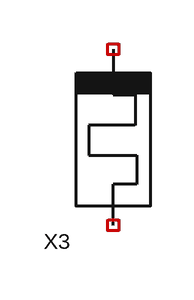
[diagram p0: schematic cell.asc]
cell.asc, the LTspice schematic file:
Version 4
SHEET 1 2484 3204
SYMBOL memristor -528 1136 R180
WINDOW 3 0 -21 Invisible 2
WINDOW 39 0 -42 Invisible 2
SYMATTR SpiceLine rmin=100 rmax=390 rinit=100 alpha=1E10 beta=0 gamma=0.1 VtR=2 VtL=-0.5 yo=0.0001 m=82 fo=310 Lo=5
SYMATTR InstName X3

The netlist it stands for:
* cell.asc
XX3 NC_01 NC_02 memristor rmin=100 rmax=390 rinit=100 alpha=1E10 beta=0 gamma=0.1 VtR=2 VtL=-0.5 yo=0.0001 m=82 fo=310 Lo=5  ; pins plus minus
.backanno
.end